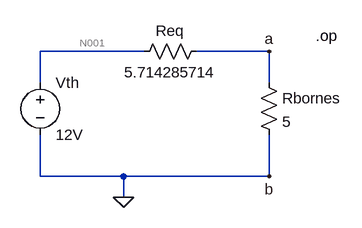
[diagram p0: schematic Thévenin+res.asc]
Thévenin+res.asc, the LTspice schematic file:
Version 4
SHEET 1 880 680
WIRE 192 80 32 80
WIRE 384 80 272 80
WIRE 32 128 32 80
WIRE 384 128 384 80
WIRE 32 272 32 208
WIRE 160 272 32 272
WIRE 384 272 384 208
WIRE 384 272 160 272
WIRE 160 304 160 272
FLAG 384 80 a
FLAG 384 272 b
FLAG 160 304 0
SYMBOL res 176 96 R270
WINDOW 0 32 56 VTop 2
WINDOW 3 0 56 VBottom 2
SYMATTR InstName Req
SYMATTR Value 5.714285714
SYMBOL voltage 32 112 R0
SYMATTR InstName Vth
SYMATTR Value 12V
SYMBOL res 368 112 R0
SYMATTR InstName Rbornes
SYMATTR Value 5
TEXT 456 56 Left 2 !.op

The netlist it stands for:
* Thévenin+res.asc
Req N001 a 5.714285714
Vth N001 0 12V
Rbornes a 0 5
.op
.backanno
.end

* Results of the author's LTspice run, read from the files saved beside the schematic
* Operating Point:
*   V(n001) = 12 V
*   V(a) = 5.6 V
*   I(Rbornes) = 1.12 A
*   I(Req) = 1.12 A
*   I(Vth) = -1.12 A